# Altium schematic sheet ARDUINO_DUE_2021-11-28.schdoc
size 82 x 139 mm
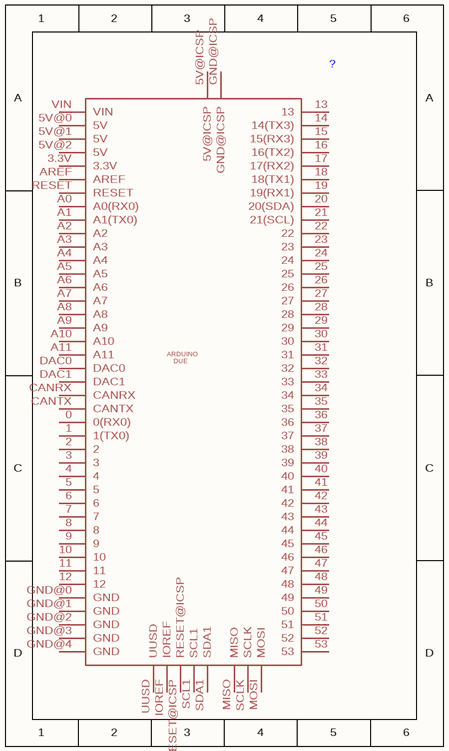
[diagram p0: ARDUINO_DUE_2021-11-28.schdoc]

## Parts
?  (no value)  [ARDUINO_DUE]

## Nets

Not connected (* = marked no-connect by the designer): ? 0(0(RX0)) 1(1(TX0)) 2 3 3.3V 4 5 5V@0(5V) 5V@1(5V) 5V@2(5V) 5V@ICSP 6 7 8 9 10 11 12 13 14(14(TX3)) 15(15(RX3)) 16(16(TX2)) 17(17(RX2)) 18(18(TX1)) 19(19(RX1)) 20(20(SDA)) 21(21(SCL)) 22 23 24 25 26 27 28 29 30 31 32 33 34 35 36 37 38 39 40 41 42 43 44 45 46 47 48 49 50 51 52 53 A0(A0(RX0)) A1(A1(TX0)) A2 A3 A4 A5 A6 A7 A8 A9 A10 A11 AREF CANRX CANTX DAC0 DAC1 GND@0(GND) GND@1(GND) GND@2(GND) GND@3(GND) GND@4(GND) GND@ICSP IOREF MISO MOSI RESET RESET@ICSP SCL1 SCLK SDA1 UUSD VIN

## Notes on the sheet
- (in symbol ARDUINO_DUE) ARDUINO / DUE

## Library data of the parts
? = ARDUINO_DUE